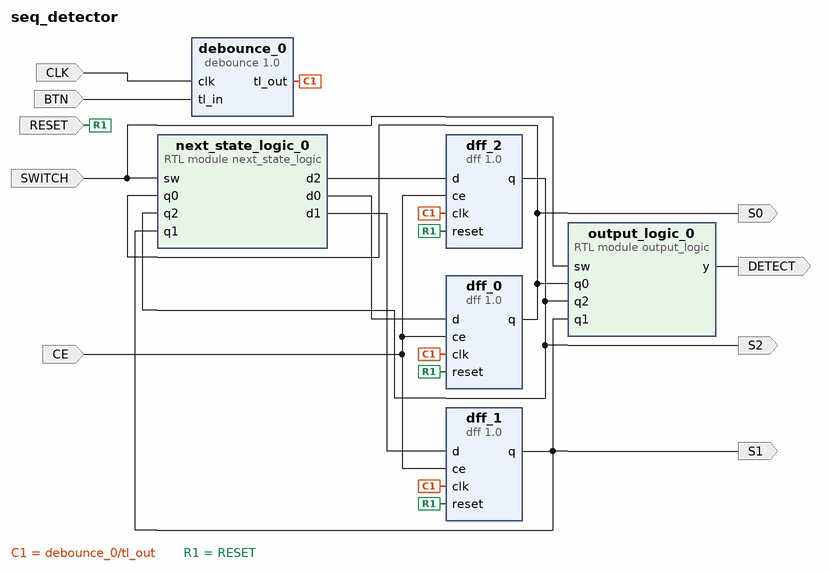
[diagram p0: block diagram of the top level]
# Vivado block design seq_detector, xc7a35tcpg236-1, Vivado 2018.2
create_bd_design seq_detector

create_bd_port -dir I SWITCH
create_bd_port -dir I RESET
create_bd_port -dir O DETECT
create_bd_port -dir I CE
create_bd_port -dir O S0
create_bd_port -dir O S1
create_bd_port -dir O S2
create_bd_port -dir I CLK
create_bd_port -dir I BTN

create_bd_cell -type module -reference next_state_logic next_state_logic_0
create_bd_cell -type module -reference output_logic output_logic_0
create_bd_cell -type ip -vlnv FIT:user:dff:1.0 dff_0
create_bd_cell -type ip -vlnv FIT:user:dff:1.0 dff_1
create_bd_cell -type ip -vlnv FIT:user:dff:1.0 dff_2
create_bd_cell -type ip -vlnv FIT:user:debounce:1.0 debounce_0
set_property -dict {CONFIG.width 4} [get_bd_cells debounce_0]

# ---- connections ----

connect_bd_net [get_bd_pins next_state_logic_0/d0] [get_bd_pins dff_0/d]
connect_bd_net [get_bd_pins next_state_logic_0/d1] [get_bd_pins dff_1/d]
connect_bd_net [get_bd_pins next_state_logic_0/d2] [get_bd_pins dff_2/d]
connect_bd_net [get_bd_pins debounce_0/tl_out] [get_bd_pins dff_2/clk] [get_bd_pins dff_1/clk] [get_bd_pins dff_0/clk]
connect_bd_net [get_bd_ports RESET] [get_bd_pins dff_0/reset] [get_bd_pins dff_1/reset] [get_bd_pins dff_2/reset]
connect_bd_net -net sw_0_1 [get_bd_ports SWITCH] [get_bd_pins next_state_logic_0/sw] [get_bd_pins output_logic_0/sw]
connect_bd_net [get_bd_pins dff_0/q] [get_bd_pins output_logic_0/q0] [get_bd_pins next_state_logic_0/q0] [get_bd_ports S0]
connect_bd_net -net q1_0_1 [get_bd_pins dff_1/q] [get_bd_pins next_state_logic_0/q1] [get_bd_pins output_logic_0/q1] [get_bd_ports S1]
connect_bd_net [get_bd_pins dff_2/q] [get_bd_pins next_state_logic_0/q2] [get_bd_pins output_logic_0/q2] [get_bd_ports S2]
connect_bd_net [get_bd_pins output_logic_0/y] [get_bd_ports DETECT]
connect_bd_net [get_bd_ports CE] [get_bd_pins dff_1/ce] [get_bd_pins dff_0/ce] [get_bd_pins dff_2/ce]
connect_bd_net -net clk_0_1 [get_bd_ports CLK] [get_bd_pins debounce_0/clk]
connect_bd_net -net tl_in_0_1 [get_bd_ports BTN] [get_bd_pins debounce_0/tl_in]

validate_bd_design
save_bd_design
